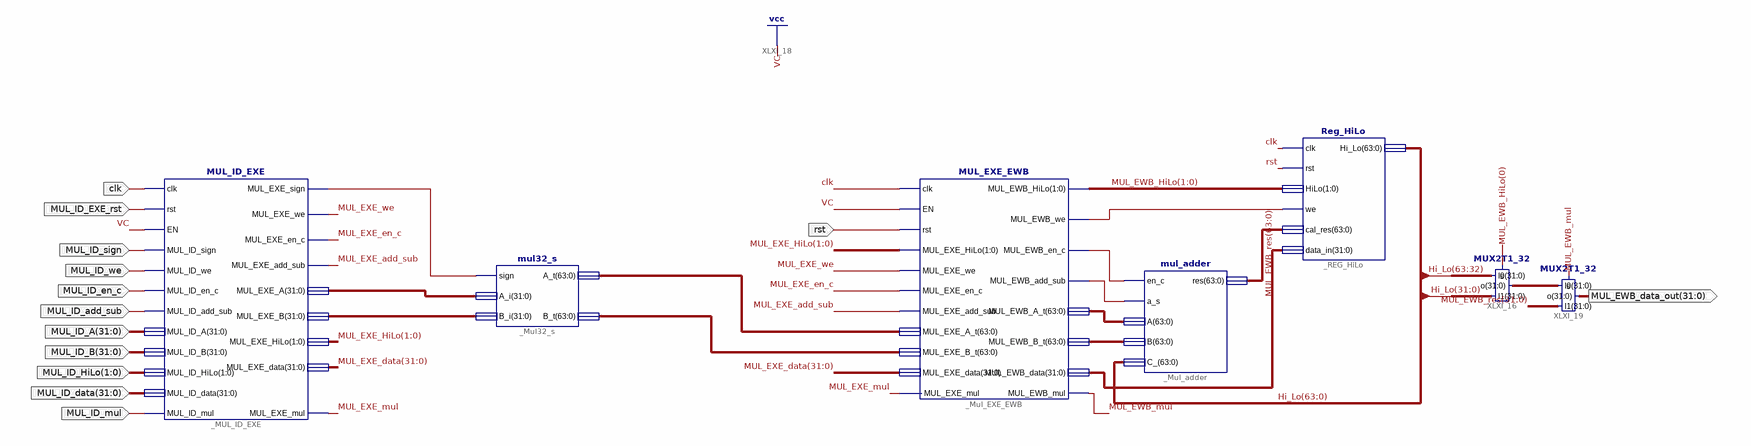
[diagram p0: schematic sheet 1]
// Xilinx ISE schematic MUL_ALU.sch (kintex7) as structural Verilog: 7 symbols, 13 ports
module MUL_ALU (
  input  clk,
  input  rst,
  input  MUL_ID_EXE_rst,
  input  MUL_ID_sign,
  input  MUL_ID_we,
  input  MUL_ID_en_c,
  input  MUL_ID_add_sub,
  input  [31:0] MUL_ID_A,
  input  [31:0] MUL_ID_B,
  input  [1:0] MUL_ID_HiLo,
  input  [31:0] MUL_ID_data,
  input  MUL_ID_mul,
  output [31:0] MUL_EWB_data_out
);

  wire MUL_EWB_mul, MUL_EXE_add_sub, MUL_EXE_en_c, MUL_EXE_mul, MUL_EXE_we, XLXN_38, XLXN_39, XLXN_85,
       XLXN_136;
  wire [1:0] MUL_EWB_HiLo, MUL_EXE_HiLo;
  wire [31:0] MUL_EXE_data, XLXN_87, XLXN_126, XLXN_133, XLXN_134;
  wire [63:0] Hi_Lo, MUL_EWB_res, XLXN_24, XLXN_25, XLXN_130, XLXN_131;

  MUL_EXE_EWB _Mul_EXE_EWB (
    .clk(clk), .EN(1'b1), .rst(rst), .MUL_EXE_A_t(XLXN_24), .MUL_EXE_B_t(XLXN_25),
    .MUL_EXE_data(MUL_EXE_data), .MUL_EWB_A_t(XLXN_131), .MUL_EWB_B_t(XLXN_130), .MUL_EWB_data(XLXN_87),
    .MUL_EXE_HiLo(MUL_EXE_HiLo), .MUL_EXE_we(MUL_EXE_we), .MUL_EXE_en_c(MUL_EXE_en_c),
    .MUL_EXE_add_sub(MUL_EXE_add_sub), .MUL_EWB_en_c(XLXN_38), .MUL_EWB_add_sub(XLXN_39),
    .MUL_EWB_HiLo(MUL_EWB_HiLo), .MUL_EWB_we(XLXN_85), .MUL_EXE_mul(MUL_EXE_mul), .MUL_EWB_mul(MUL_EWB_mul));
  mul_adder _Mul_adder (.A(XLXN_131), .B(XLXN_130), .C_(Hi_Lo), .res(MUL_EWB_res), .en_c(XLXN_38), .a_s(XLXN_39));
  Reg_HiLo _REG_HiLo (
    .clk(clk), .rst(rst), .Hi_Lo(Hi_Lo), .we(XLXN_85), .cal_res(MUL_EWB_res), .data_in(XLXN_87),
    .HiLo(MUL_EWB_HiLo));
  MUX2T1_32 XLXI_16 (.s(MUL_EWB_HiLo[0]), .I0(Hi_Lo[63:32]), .I1(Hi_Lo[31:0]), .o(XLXN_126));
  MUL_ID_EXE _MUL_ID_EXE (
    .clk(clk), .rst(MUL_ID_EXE_rst), .EN(1'b1), .MUL_ID_sign(MUL_ID_sign), .MUL_ID_we(MUL_ID_we),
    .MUL_ID_en_c(MUL_ID_en_c), .MUL_ID_add_sub(MUL_ID_add_sub), .MUL_ID_A(MUL_ID_A), .MUL_ID_B(MUL_ID_B),
    .MUL_ID_HiLo(MUL_ID_HiLo), .MUL_ID_data(MUL_ID_data), .MUL_EXE_sign(XLXN_136), .MUL_EXE_we(MUL_EXE_we),
    .MUL_EXE_en_c(MUL_EXE_en_c), .MUL_EXE_add_sub(MUL_EXE_add_sub), .MUL_EXE_A(XLXN_133),
    .MUL_EXE_B(XLXN_134), .MUL_EXE_HiLo(MUL_EXE_HiLo), .MUL_EXE_data(MUL_EXE_data), .MUL_ID_mul(MUL_ID_mul),
    .MUL_EXE_mul(MUL_EXE_mul));
  MUX2T1_32 XLXI_19 (.s(MUL_EWB_mul), .I0(XLXN_126), .I1(MUL_EWB_res[31:0]), .o(MUL_EWB_data_out));
  mul32_s _Mul32_s (.sign(XLXN_136), .A_i(XLXN_133), .B_i(XLXN_134), .A_t(XLXN_24), .B_t(XLXN_25));
endmodule
